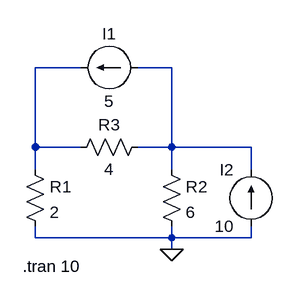
[diagram p0: schematic Q2.asc]
Q2.asc, the LTspice schematic file:
Version 4
SHEET 1 880 680
WIRE 144 -16 80 -16
WIRE 272 -16 224 -16
WIRE 80 96 80 -16
WIRE 144 96 80 96
WIRE 272 96 272 -16
WIRE 272 96 224 96
WIRE 384 96 272 96
WIRE 80 128 80 96
WIRE 272 128 272 96
WIRE 384 128 384 96
WIRE 80 224 80 208
WIRE 272 224 272 208
WIRE 272 224 80 224
WIRE 384 224 384 208
WIRE 384 224 272 224
WIRE 272 240 272 224
FLAG 272 240 0
SYMBOL res 64 112 R0
SYMATTR InstName R1
SYMATTR Value 2
SYMBOL res 256 112 R0
SYMATTR InstName R2
SYMATTR Value 6
SYMBOL res 240 80 R90
WINDOW 0 0 56 VBottom 2
WINDOW 3 32 56 VTop 2
SYMATTR InstName R3
SYMATTR Value 4
SYMBOL current 224 -16 R90
WINDOW 0 -32 40 VBottom 2
WINDOW 3 32 40 VTop 2
WINDOW 123 0 0 Left 0
WINDOW 39 0 0 Left 0
SYMATTR InstName I1
SYMATTR Value 5
SYMBOL current 384 208 R180
WINDOW 0 24 80 Left 2
WINDOW 3 24 0 Left 2
WINDOW 123 0 0 Left 0
WINDOW 39 0 0 Left 0
SYMATTR InstName I2
SYMATTR Value 10
TEXT 62 264 Left 2 !.tran 10

The netlist it stands for:
* Q2.asc
R1 N001 0 2
R2 N002 0 6
R3 N002 N001 4
I1 N002 N001 5
I2 0 N002 10
.tran 10
.backanno
.end